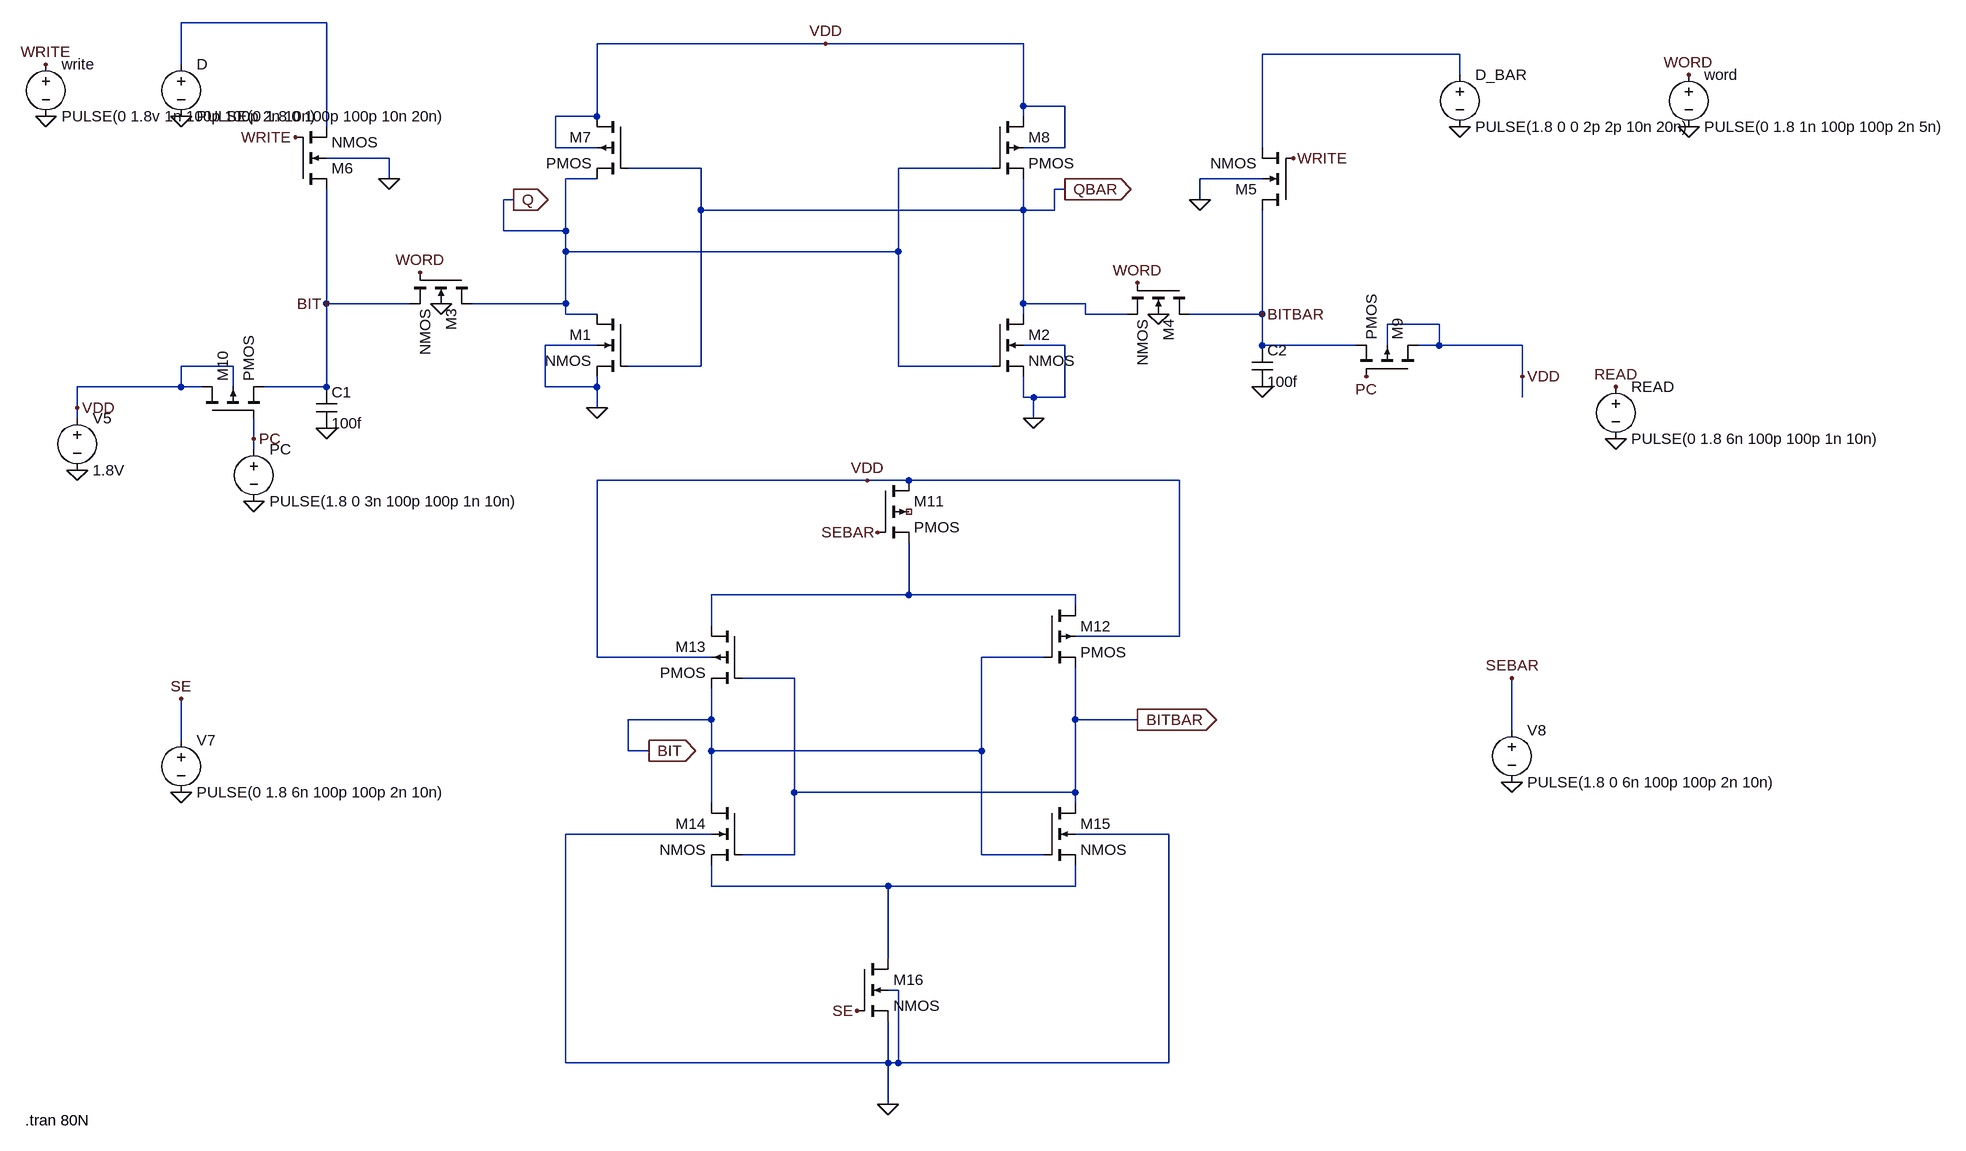
[diagram p0: schematic sram6t.asc]
sram6t.asc, the LTspice schematic file:
Version 4
SHEET 1 1972 1432
WIRE -544 -272 -768 -272
WIRE 224 -240 -128 -240
WIRE 528 -240 224 -240
WIRE 1200 -224 896 -224
WIRE -768 -208 -768 -272
WIRE 1200 -192 1200 -224
WIRE 528 -144 528 -240
WIRE 592 -144 528 -144
WIRE -128 -128 -128 -240
WIRE -128 -128 -192 -128
WIRE 528 -128 528 -144
WIRE -544 -112 -544 -272
WIRE -192 -80 -192 -128
WIRE -128 -80 -192 -80
WIRE 592 -80 592 -144
WIRE 592 -80 528 -80
WIRE 896 -80 896 -224
WIRE -448 -64 -544 -64
WIRE 32 -48 -80 -48
WIRE 480 -48 336 -48
WIRE -448 -32 -448 -64
WIRE -128 -32 -176 -32
WIRE 896 -32 800 -32
WIRE 592 -16 576 -16
WIRE -256 0 -272 0
WIRE 800 0 800 -32
WIRE 32 16 32 -48
WIRE 528 16 528 -32
WIRE 528 16 32 16
WIRE 576 16 576 -16
WIRE 576 16 528 16
WIRE -272 48 -272 0
WIRE -176 48 -176 -32
WIRE -176 48 -272 48
WIRE -176 80 -176 48
WIRE 336 80 336 -48
WIRE 336 80 -176 80
WIRE -544 160 -544 -16
WIRE -416 160 -544 160
WIRE -176 160 -176 80
WIRE -176 160 -320 160
WIRE 528 160 528 16
WIRE 624 160 528 160
WIRE -176 176 -176 160
WIRE -128 176 -176 176
WIRE 528 176 528 160
WIRE 624 176 624 160
WIRE 688 176 624 176
WIRE 896 176 896 16
WIRE 896 176 784 176
WIRE 1168 192 1088 192
WIRE -128 224 -208 224
WIRE 592 224 528 224
WIRE 896 224 896 176
WIRE 1040 224 896 224
WIRE 1088 224 1088 192
WIRE 1168 224 1168 192
WIRE 1168 224 1136 224
WIRE 1296 224 1168 224
WIRE -688 256 -768 256
WIRE 32 256 32 16
WIRE 32 256 -80 256
WIRE 336 256 336 80
WIRE 480 256 336 256
WIRE 1296 272 1296 224
WIRE -768 288 -768 256
WIRE -768 288 -928 288
WIRE -736 288 -768 288
WIRE -688 288 -688 256
WIRE -544 288 -544 160
WIRE -544 288 -640 288
WIRE -208 288 -208 224
WIRE -128 288 -128 272
WIRE -128 288 -208 288
WIRE 528 304 528 272
WIRE 544 304 528 304
WIRE 592 304 592 224
WIRE 592 304 544 304
WIRE 1296 304 1296 272
WIRE -928 320 -928 288
WIRE -128 320 -128 288
WIRE -928 336 -928 320
WIRE 544 336 544 304
WIRE -656 368 -656 336
WIRE -656 384 -656 368
WIRE 288 432 -128 432
WIRE 352 432 288 432
WIRE 768 432 352 432
WIRE 352 608 352 528
WIRE 352 608 48 608
WIRE 608 608 352 608
WIRE 608 624 608 608
WIRE 48 656 48 608
WIRE 768 672 768 432
WIRE 768 672 608 672
WIRE -128 704 -128 432
WIRE 48 704 -128 704
WIRE 560 704 464 704
WIRE 176 736 96 736
WIRE 48 800 48 752
WIRE 48 800 -80 800
WIRE 608 800 608 720
WIRE 704 800 608 800
WIRE 1280 816 1280 736
WIRE -768 832 -768 768
WIRE -80 848 -80 800
WIRE -48 848 -80 848
WIRE 48 848 48 800
WIRE 464 848 464 704
WIRE 464 848 48 848
WIRE 176 912 176 736
WIRE 608 912 608 800
WIRE 608 912 176 912
WIRE 48 928 48 848
WIRE 608 928 608 912
WIRE 48 976 -176 976
WIRE 752 976 608 976
WIRE 176 1008 176 912
WIRE 176 1008 96 1008
WIRE 464 1008 464 848
WIRE 560 1008 464 1008
WIRE 48 1056 48 1024
WIRE 320 1056 48 1056
WIRE 608 1056 608 1024
WIRE 608 1056 320 1056
WIRE 320 1168 320 1056
WIRE 336 1216 320 1216
WIRE -176 1328 -176 976
WIRE 320 1328 320 1264
WIRE 320 1328 -176 1328
WIRE 336 1328 336 1216
WIRE 336 1328 320 1328
WIRE 752 1328 752 976
WIRE 752 1328 336 1328
WIRE 320 1392 320 1328
FLAG -544 352 0
FLAG 896 288 0
FLAG -368 160 0
FLAG 736 176 0
FLAG -768 912 0
FLAG 1280 896 0
FLAG 704 800 BITBAR
IOPIN 704 800 Out
FLAG -48 848 BIT
IOPIN -48 848 Out
FLAG -768 -128 0
FLAG -976 -128 0
FLAG -928 416 0
FLAG 1440 368 0
FLAG 1280 736 SEBAR
FLAG 304 512 SEBAR
FLAG -768 768 SE
FLAG 272 1248 SE
FLAG 320 1392 0
FLAG 1440 288 READ
FLAG 1552 -192 WORD
FLAG 1552 -112 0
FLAG -976 -208 WRITE
FLAG -656 464 0
FLAG -656 368 PC
FLAG 1056 272 PC
FLAG 800 0 0
FLAG -448 -32 0
FLAG -928 320 VDD
FLAG 1296 272 VDD
FLAG 224 -240 VDD
FLAG 288 432 VDD
FLAG -592 -96 WRITE
FLAG 944 -64 WRITE
FLAG 1200 -112 0
FLAG -128 320 0
FLAG 544 336 0
FLAG -400 112 WORD
FLAG 704 128 WORD
FLAG 896 176 BITBAR
FLAG -544 160 BIT
FLAG -256 0 Q
IOPIN -256 0 Out
FLAG 592 -16 QBAR
IOPIN 592 -16 Out
SYMBOL nmos4 -80 176 M0
SYMATTR InstName M1
SYMATTR Value2 l=180n w=540n
SYMBOL nmos4 480 176 R0
SYMATTR InstName M2
SYMATTR Value2 l=180n w=540n
SYMBOL nmos4 -320 112 R90
SYMATTR InstName M3
SYMATTR Value2 l=180n w=270n
SYMBOL nmos4 784 128 R90
SYMATTR InstName M4
SYMATTR Value2 l=180n w=270n
SYMBOL nmos4 944 16 R180
SYMATTR InstName M5
SYMATTR Value2 l=180n w=720n
SYMBOL nmos4 -592 -16 M180
SYMATTR InstName M6
SYMATTR Value2 l=180n w=720n
SYMBOL pmos4 -80 -128 M0
SYMATTR InstName M7
SYMATTR Value2 l=180n w=180n
SYMBOL pmos4 480 -128 R0
SYMATTR InstName M8
SYMATTR Value2 l=180n w=180n
SYMBOL pmos4 1136 272 M270
SYMATTR InstName M9
SYMATTR Value2 l=180n w=360n
SYMBOL pmos4 -736 336 R270
SYMATTR InstName M10
SYMATTR Value2 l=180n w=360n
SYMBOL pmos4 304 432 R0
SYMATTR InstName M11
SYMATTR Value2 l=180n w=360n
SYMBOL pmos4 560 624 R0
SYMATTR InstName M12
SYMATTR Value2 l=180n w=360n
SYMBOL pmos4 96 656 M0
SYMATTR InstName M13
SYMATTR Value2 l=180n w=270n
SYMBOL nmos4 96 928 M0
SYMATTR InstName M14
SYMATTR Value2 l=180n w=270n
SYMBOL nmos4 560 928 R0
SYMATTR InstName M15
SYMATTR Value2 l=180n w=270n
SYMBOL nmos4 272 1168 R0
SYMATTR InstName M16
SYMATTR Value2 l=180n w=360n
SYMBOL cap -560 288 R0
SYMATTR InstName C1
SYMATTR Value 100f
SYMBOL cap 880 224 R0
SYMATTR InstName C2
SYMATTR Value 100f
SYMBOL voltage -768 -224 R0
WINDOW 123 0 0 Left 0
WINDOW 39 0 0 Left 0
SYMATTR InstName D
SYMATTR Value PULSE(0 1.8 0 100p 100p 10n 20n)
SYMBOL voltage 1200 -208 R0
WINDOW 123 0 0 Left 0
WINDOW 39 0 0 Left 0
SYMATTR InstName D_BAR
SYMATTR Value PULSE(1.8 0 0 2p 2p 10n 20n)
SYMBOL voltage 1440 272 R0
WINDOW 123 0 0 Left 0
WINDOW 39 0 0 Left 0
SYMATTR InstName READ
SYMATTR Value PULSE(0 1.8 6n 100p 100p 1n 10n)
SYMBOL voltage -976 -224 R0
WINDOW 123 0 0 Left 0
WINDOW 39 0 0 Left 0
SYMATTR InstName write
SYMATTR Value PULSE(0 1.8v 1n 100p 100p 2n 10n)
SYMBOL voltage -928 320 R0
WINDOW 123 0 0 Left 0
WINDOW 39 0 0 Left 0
SYMATTR InstName V5
SYMATTR Value 1.8V
SYMBOL voltage -656 368 R0
WINDOW 123 0 0 Left 0
WINDOW 39 0 0 Left 0
SYMATTR InstName PC
SYMATTR Value PULSE(1.8 0 3n 100p 100p 1n 10n)
SYMBOL voltage -768 816 R0
WINDOW 123 0 0 Left 0
WINDOW 39 0 0 Left 0
SYMATTR InstName V7
SYMATTR Value PULSE(0 1.8 6n 100p 100p 2n 10n)
SYMBOL voltage 1280 800 R0
WINDOW 123 0 0 Left 0
WINDOW 39 0 0 Left 0
SYMATTR InstName V8
SYMATTR Value PULSE(1.8 0 6n 100p 100p 2n 10n)
SYMBOL voltage 1552 -208 R0
WINDOW 123 0 0 Left 0
WINDOW 39 0 0 Left 0
SYMATTR InstName word
SYMATTR Value PULSE(0 1.8 1n 100p 100p 2n 5n)
TEXT -1008 1416 Left 2 !.tran 80N

The netlist it stands for:
* sram6t.asc
M1 Q QBAR 0 0 NMOS l=180n w=540n
M2 QBAR Q 0 0 NMOS l=180n w=540n
M3 Q WORD BIT 0 NMOS l=180n w=270n
M4 BITBAR WORD QBAR 0 NMOS l=180n w=270n
M5 BITBAR WRITE N002 0 NMOS l=180n w=720n
M6 BIT WRITE N001 0 NMOS l=180n w=720n
M7 VDD QBAR Q VDD PMOS l=180n w=180n
M8 VDD Q QBAR VDD PMOS l=180n w=180n
M9 VDD PC BITBAR VDD PMOS l=180n w=360n
M10 VDD PC BIT VDD PMOS l=180n w=360n
M11 VDD SEBAR N003 NC_01 PMOS l=180n w=360n
M12 N003 BIT BITBAR VDD PMOS l=180n w=360n
M13 N003 BITBAR BIT VDD PMOS l=180n w=270n
M14 BIT BITBAR N004 0 NMOS l=180n w=270n
M15 BITBAR BIT N004 0 NMOS l=180n w=270n
M16 N004 SE 0 0 NMOS l=180n w=360n
C1 BIT 0 100f
C2 BITBAR 0 100f
V§D N001 0 PULSE(0 1.8 0 100p 100p 10n 20n)
V§D_BAR N002 0 PULSE(1.8 0 0 2p 2p 10n 20n)
V§READ READ 0 PULSE(0 1.8 6n 100p 100p 1n 10n)
V§write WRITE 0 PULSE(0 1.8v 1n 100p 100p 2n 10n)
V5 VDD 0 1.8V
V§PC PC 0 PULSE(1.8 0 3n 100p 100p 1n 10n)
V7 SE 0 PULSE(0 1.8 6n 100p 100p 2n 10n)
V8 SEBAR 0 PULSE(1.8 0 6n 100p 100p 2n 10n)
V§word WORD 0 PULSE(0 1.8 1n 100p 100p 2n 5n)
.model NMOS NMOS
.model PMOS PMOS
.lib standard.mos
.tran 80N
.backanno
.end